# EasyEDA schematic hat.json

## Sheets
1 Sheet_1: TITLE: Sheet_1; REV: 1.0; Date: 2024-01-21; Sheet: 1/1; Drawn By: taylor; Company: Your Company
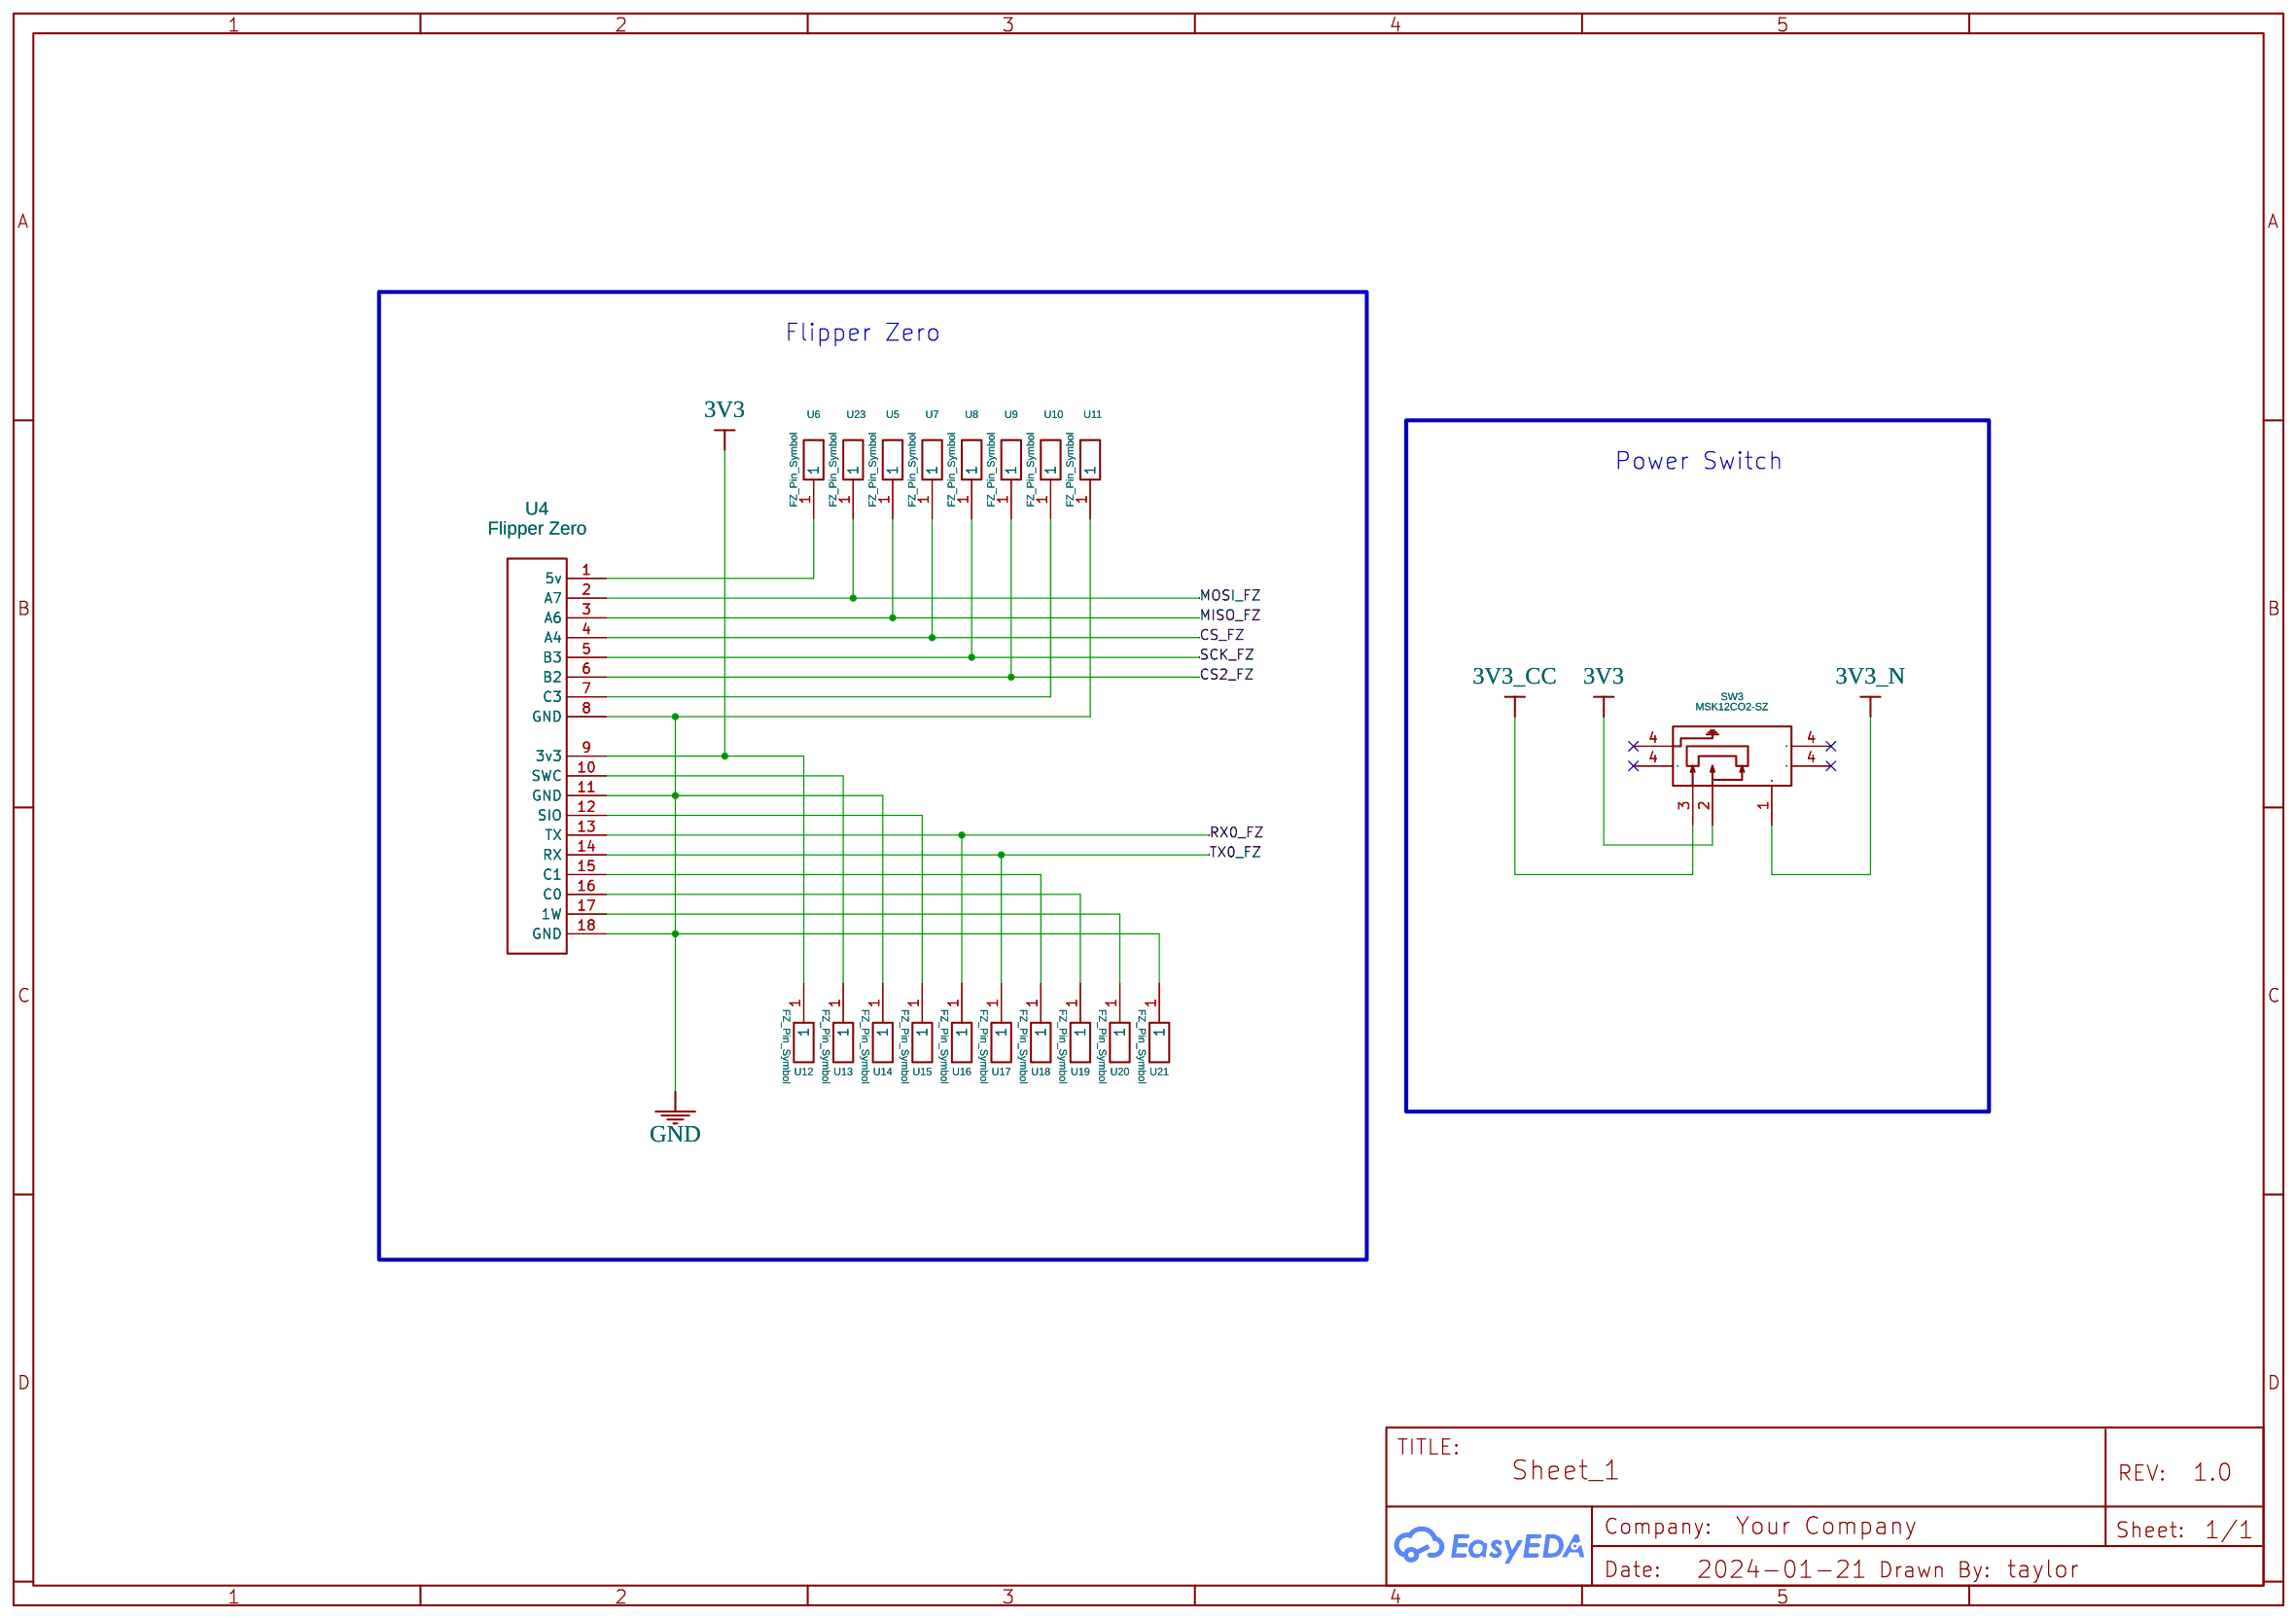
[diagram p0: Sheet_1]
2 Sheet_2: TITLE: Sheet_2
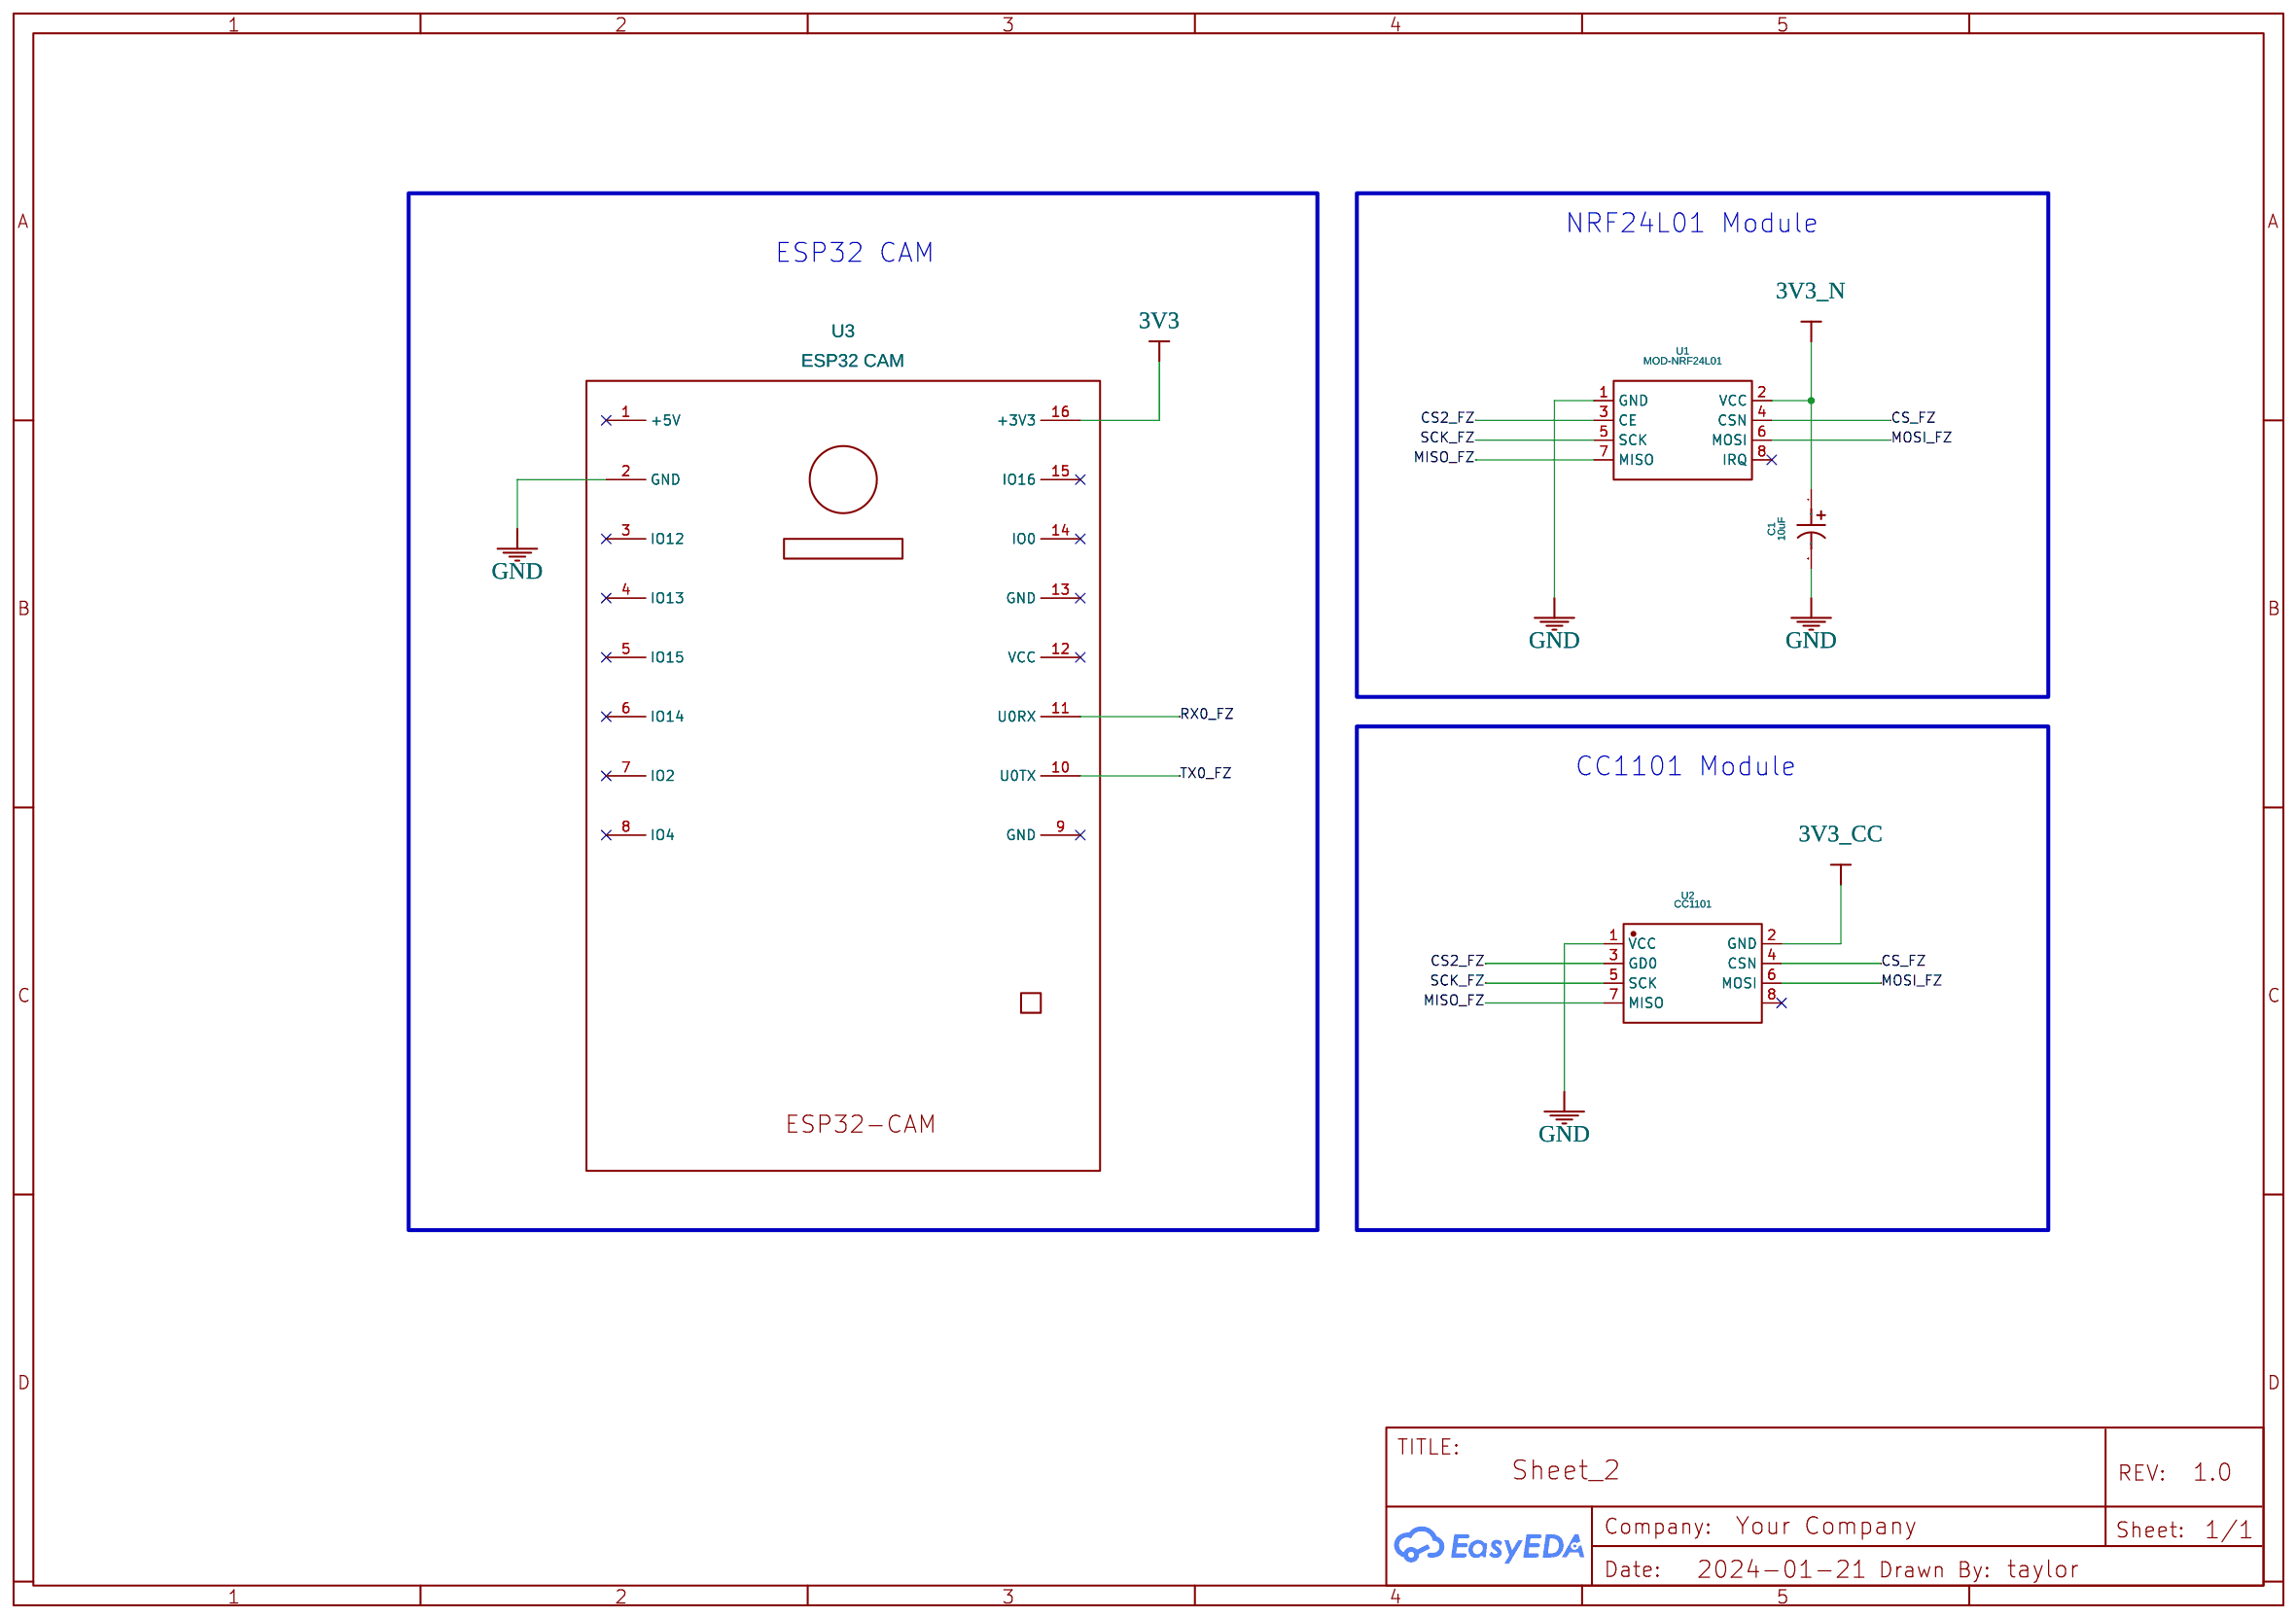
[diagram p1: Sheet_2]

## Parts
sheet Sheet_1
SW3  MSK12CO2-SZ  [SW-TH_MSK12C02]
U4  Flipper Zero  [FLIPPER ZERO]
U5  FZ_Pin_Symbol  [FLIPPER ZERO PIN FOOTPRINT]
U6  FZ_Pin_Symbol  [FLIPPER ZERO PIN FOOTPRINT]
U7  FZ_Pin_Symbol  [FLIPPER ZERO PIN FOOTPRINT]
U8  FZ_Pin_Symbol  [FLIPPER ZERO PIN FOOTPRINT]
U9  FZ_Pin_Symbol  [FLIPPER ZERO PIN FOOTPRINT]
U10  FZ_Pin_Symbol  [FLIPPER ZERO PIN FOOTPRINT]
U11  FZ_Pin_Symbol  [FLIPPER ZERO PIN FOOTPRINT]
U12  FZ_Pin_Symbol  [FLIPPER ZERO PIN FOOTPRINT]
U13  FZ_Pin_Symbol  [FLIPPER ZERO PIN FOOTPRINT]
U14  FZ_Pin_Symbol  [FLIPPER ZERO PIN FOOTPRINT]
U15  FZ_Pin_Symbol  [FLIPPER ZERO PIN FOOTPRINT]
U16  FZ_Pin_Symbol  [FLIPPER ZERO PIN FOOTPRINT]
U17  FZ_Pin_Symbol  [FLIPPER ZERO PIN FOOTPRINT]
U18  FZ_Pin_Symbol  [FLIPPER ZERO PIN FOOTPRINT]
U19  FZ_Pin_Symbol  [FLIPPER ZERO PIN FOOTPRINT]
U20  FZ_Pin_Symbol  [FLIPPER ZERO PIN FOOTPRINT]
U21  FZ_Pin_Symbol  [FLIPPER ZERO PIN FOOTPRINT]
U23  FZ_Pin_Symbol  [FLIPPER ZERO PIN FOOTPRINT]
sheet Sheet_2
C1  10uF  [CAP-SMD_BD5.0-L5.3-W5.3-FD]
U1  MOD-NRF24L01  [MOD-NRF24L01-HDR]
U2  CC1101  [CC1101]
U3  ESP32 CAM  [ESP32-CAM]

## Library data of the parts
SW3 = MSK12CO2-SZ: Contributor: LCSC; Supplier: LCSC; Supplier Part: C2681568; Manufacturer: SHOU HAN(首韩); JLCPCB Part Class: Extended Part
U4 = Flipper Zero: Contributor: theo.digiacomo1
U5-U21 U23 = FZ_Pin_Symbol: Contributor: musangi
C1 = RST10UF50V016: Supplier: LCSC; Supplier Part: C4747971; Manufacturer: KNSCHA(科尼盛); JLCPCB Part Class: Extended Part; Contributor: lcsc
U1 = MOD-NRF24L01: Contributor: jackyw1368
U2 = CC1101: Contributor: gabrieln2002
U3 = ESP32 CAM: Supplier: aliexpress; Contributor: cempamirbanas

## Nets
3V3: SW3.2 U3.16(+3V3) U4.9(3v3) U12.1
3V3_CC: SW3.3 U2.2(GND)
3V3_N: C1.1 SW3.1 U1.2(VCC)
GND: C1.2 U1.1(GND) U2.1(VCC) U3.2(GND) U4.8(GND) U4.11(GND) U4.18(GND) U11.1 U14.1 U21.1
CS2_FZ: U1.3(CE) U2.3(GD0) U4.6(B2) U9.1
CS_FZ: U1.4(CSN) U2.4(CSN) U4.4(A4) U7.1
MISO_FZ: U1.7(MISO) U2.7(MISO) U4.3(A6) U5.1
MOSI_FZ: U1.6(MOSI) U2.6(MOSI) U4.2(A7) U23.1
RX0_FZ: U3.11(U0RX) U4.13(TX) U16.1
SCK_FZ: U1.5(SCK) U2.5(SCK) U4.5(B3) U8.1
TX0_FZ: U3.10(U0TX) U4.14(RX) U17.1
Net-(U4-1): U4.1(5v) U6.1
Net-(U4-7): U4.7(C3) U10.1
Net-(U4-10): U4.10(SWC) U13.1
Net-(U4-12): U4.12(SIO) U15.1
Net-(U4-15): U4.15(C1) U18.1
Net-(U4-16): U4.16(C0) U19.1
Net-(U4-17): U4.17(1W) U20.1

Not connected (* = marked no-connect by the designer): SW3 4*; U1 8(IRQ)*; U2 8*; U3 1(+5V)* 3(IO12)* 4(IO13)* 5(IO15)* 6(IO14)* 7(IO2)* 8(IO4)* 9(GND)* 12(VCC)* 13(GND)* 14(IO0)* 15(IO16)*

## Notes on the sheets
sheet 1
- Flipper Zero
- Power Switch
sheet 2
- NRF24L01 Module
- ESP32 CAM
- СС1101 Module
